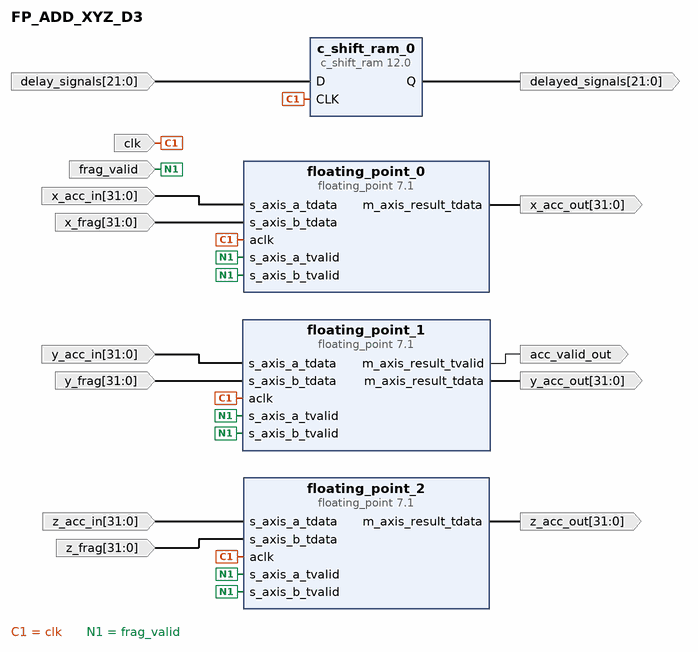
[diagram p0: block diagram of the top level]
# Vivado block design FP_ADD_XYZ_D3, xcu280-fsvh2892-2L-e, Vivado 2021.2
create_bd_design FP_ADD_XYZ_D3

create_bd_port -dir O acc_valid_out
create_bd_port -dir I -type clk clk
set_property -dict {CONFIG.FREQ_HZ 10000000} [get_bd_ports clk]
create_bd_port -dir I -from 21 -to 0 -type data delay_signals
create_bd_port -dir O -from 21 -to 0 -type data delayed_signals
create_bd_port -dir I frag_valid
create_bd_port -dir I -from 31 -to 0 x_acc_in
create_bd_port -dir O -from 31 -to 0 x_acc_out
create_bd_port -dir I -from 31 -to 0 x_frag
create_bd_port -dir I -from 31 -to 0 y_acc_in
create_bd_port -dir O -from 31 -to 0 y_acc_out
create_bd_port -dir I -from 31 -to 0 y_frag
create_bd_port -dir I -from 31 -to 0 z_acc_in
create_bd_port -dir O -from 31 -to 0 z_acc_out
create_bd_port -dir I -from 31 -to 0 z_frag

create_bd_cell -type ip -vlnv xilinx.com:ip:c_shift_ram:12.0 c_shift_ram_0
set_property -dict {CONFIG.Depth 3 CONFIG.Width 22} [get_bd_cells c_shift_ram_0]
create_bd_cell -type ip -vlnv xilinx.com:ip:floating_point:7.1 floating_point_0
set_property -dict [list \
  CONFIG.Add_Sub_Value Add \
  CONFIG.C_Latency 3 \
  CONFIG.Flow_Control NonBlocking \
  CONFIG.Has_RESULT_TREADY false \
  CONFIG.Maximum_Latency false \
] [get_bd_cells floating_point_0]
create_bd_cell -type ip -vlnv xilinx.com:ip:floating_point:7.1 floating_point_1
set_property -dict [list \
  CONFIG.Add_Sub_Value Add \
  CONFIG.C_Latency 3 \
  CONFIG.Flow_Control NonBlocking \
  CONFIG.Has_RESULT_TREADY false \
  CONFIG.Maximum_Latency false \
] [get_bd_cells floating_point_1]
create_bd_cell -type ip -vlnv xilinx.com:ip:floating_point:7.1 floating_point_2
set_property -dict [list \
  CONFIG.Add_Sub_Value Add \
  CONFIG.C_Latency 3 \
  CONFIG.Flow_Control NonBlocking \
  CONFIG.Has_RESULT_TREADY false \
  CONFIG.Maximum_Latency false \
] [get_bd_cells floating_point_2]

# ---- connections ----

connect_bd_net -net D_0_1 [get_bd_ports delay_signals] [get_bd_pins c_shift_ram_0/D]
connect_bd_net -net aclk_0_1 [get_bd_ports clk] \
  [get_bd_pins c_shift_ram_0/CLK] [get_bd_pins floating_point_0/aclk] [get_bd_pins floating_point_1/aclk] \
  [get_bd_pins floating_point_2/aclk]
connect_bd_net [get_bd_pins c_shift_ram_0/Q] [get_bd_ports delayed_signals]
connect_bd_net [get_bd_pins floating_point_0/m_axis_result_tdata] [get_bd_ports x_acc_out]
connect_bd_net [get_bd_pins floating_point_1/m_axis_result_tdata] [get_bd_ports y_acc_out]
connect_bd_net [get_bd_pins floating_point_1/m_axis_result_tvalid] [get_bd_ports acc_valid_out]
connect_bd_net [get_bd_pins floating_point_2/m_axis_result_tdata] [get_bd_ports z_acc_out]
connect_bd_net -net s_axis_a_tdata_0_1 [get_bd_ports z_acc_in] [get_bd_pins floating_point_2/s_axis_a_tdata]
connect_bd_net -net s_axis_a_tdata_1_1 [get_bd_ports y_acc_in] [get_bd_pins floating_point_1/s_axis_a_tdata]
connect_bd_net -net s_axis_a_tdata_2_1 [get_bd_ports x_acc_in] [get_bd_pins floating_point_0/s_axis_a_tdata]
connect_bd_net -net s_axis_a_tvalid_0_1 [get_bd_ports frag_valid] \
  [get_bd_pins floating_point_0/s_axis_a_tvalid] [get_bd_pins floating_point_0/s_axis_b_tvalid] \
  [get_bd_pins floating_point_1/s_axis_a_tvalid] [get_bd_pins floating_point_1/s_axis_b_tvalid] \
  [get_bd_pins floating_point_2/s_axis_a_tvalid] [get_bd_pins floating_point_2/s_axis_b_tvalid]
connect_bd_net -net s_axis_b_tdata_0_1 [get_bd_ports z_frag] [get_bd_pins floating_point_2/s_axis_b_tdata]
connect_bd_net -net s_axis_b_tdata_1_1 [get_bd_ports y_frag] [get_bd_pins floating_point_1/s_axis_b_tdata]
connect_bd_net -net s_axis_b_tdata_2_1 [get_bd_ports x_frag] [get_bd_pins floating_point_0/s_axis_b_tdata]

validate_bd_design
save_bd_design
